# EAGLE schematic 909 Rim_potless (EAGLE 7.1.0)
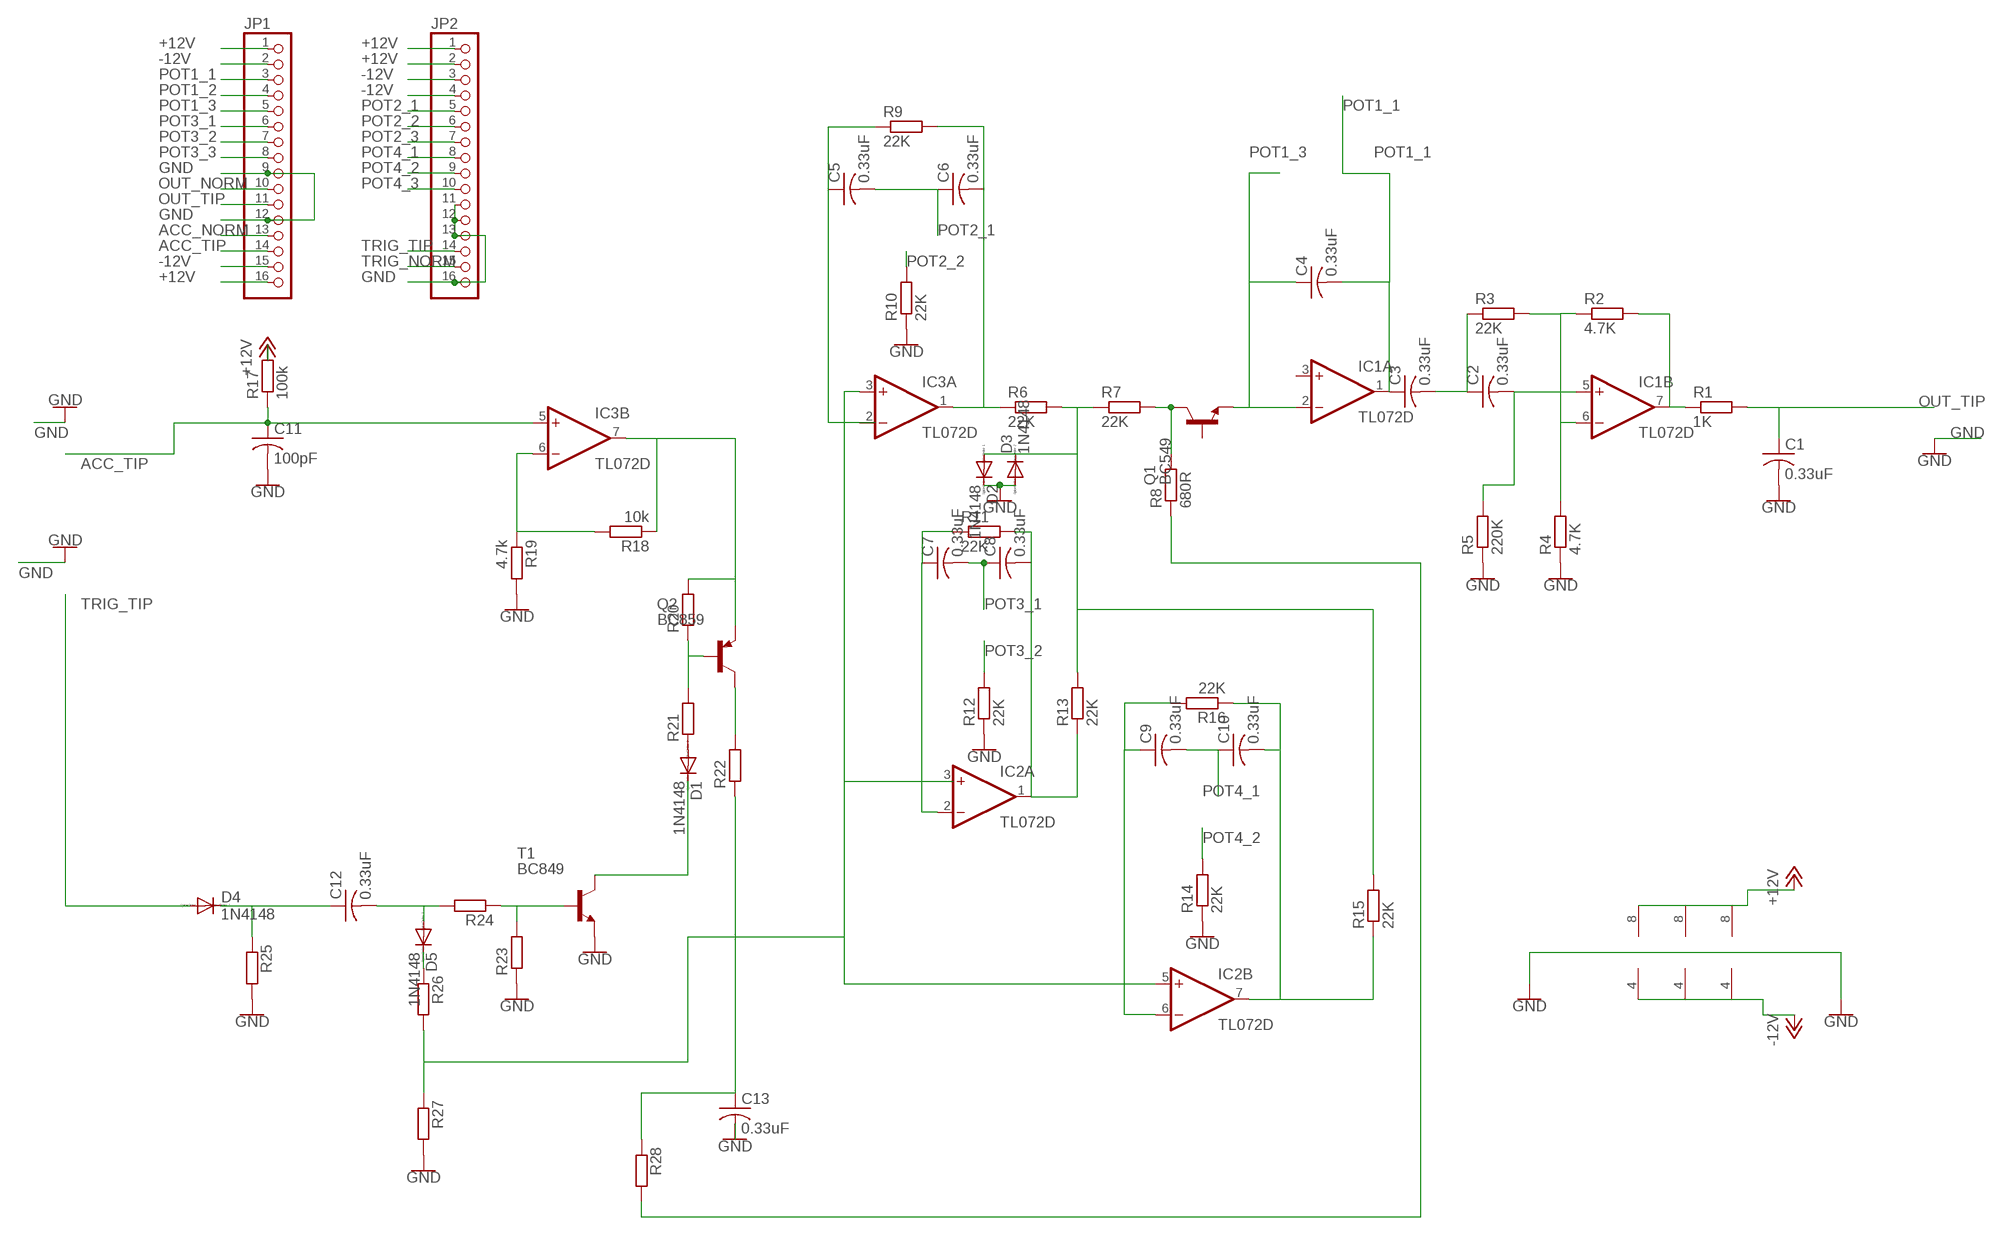
[diagram p0: schematic, sheet 1]

## Parts
C1  0.33uF  C-USC0603K  [C0603K]
C2  0.33uF  C-USC0603K  [C0603K]
C3  0.33uF  C-USC0603K  [C0603K]
C4  0.33uF  C-USC0603K  [C0603K]
C5  0.33uF  C-USC0603K  [C0603K]
C6  0.33uF  C-USC0603K  [C0603K]
C7  0.33uF  C-USC0603K  [C0603K]
C8  0.33uF  C-USC0603K  [C0603K]
C9  0.33uF  C-USC0603K  [C0603K]
C10  0.33uF  C-USC0603K  [C0603K]
C11  100pF  C-USC0603K  [C0603K]
C12  0.33uF  C-USC0603K  [C0603K]
C13  0.33uF  C-USC0603K  [C0603K]
D1  1N4148  1N4148SOD-323  [SOD323W_INFINEON]
D2  1N4148  1N4148SOD-323  [SOD323W_INFINEON]
D3  1N4148  1N4148SOD-323  [SOD323W_INFINEON]
D4  1N4148  1N4148SOD-323  [SOD323W_INFINEON]
D5  1N4148  1N4148SOD-323  [SOD323W_INFINEON]
IC1  TL072D  [SO08]
IC2  TL072D  [SO08]
IC3  TL072D  [SO08]
JP1  PINHD-1X16  [1X16]
JP2  PINHD-1X16  [1X16]
Q1  BC549  BC849  [SOT23]
Q2  BC859  BC857ASMD  [SOT23-BEC]
R1  1K  R-EU_R0603  [R0603]
R2  4.7K  R-EU_R0603  [R0603]
R3  22K  R-EU_R0603  [R0603]
R4  4.7K  R-EU_R0603  [R0603]
R5  220K  R-EU_R0603  [R0603]
R6  22K  R-EU_R0603  [R0603]
R7  22K  R-EU_R0603  [R0603]
R8  680R  R-EU_R0603  [R0603]
R9  22K  R-EU_R0603  [R0603]
R10  22K  R-EU_R0603  [R0603]
R11  22K  R-EU_R0603  [R0603]
R12  22K  R-EU_R0603  [R0603]
R13  22K  R-EU_R0603  [R0603]
R14  22K  R-EU_R0603  [R0603]
R15  22K  R-EU_R0603  [R0603]
R16  22K  R-EU_R0603  [R0603]
R17  100k  R-EU_R0603  [R0603]
R18  10k  R-EU_R0603  [R0603]
R19  4.7k  R-EU_R0603  [R0603]
R20  R-EU_R0603  [R0603]
R21  R-EU_R0603  [R0603]
R22  R-EU_R0603  [R0603]
R23  R-EU_R0603  [R0603]
R24  R-EU_R0603  [R0603]
R25  R-EU_R0603  [R0603]
R26  R-EU_R0603  [R0603]
R27  R-EU_R0603  [R0603]
R28  R-EU_R0603  [R0603]
T1  BC849  [SOT23]

## Nets
+12V: IC1.8(P:V+) JP1.1 JP1.16 JP2.1 JP2.2 R17.2
-12V: IC1.4(P:V-) JP1.2 JP1.15 JP2.3 JP2.4
ACC_NORM: JP1.13
ACC_TIP: C11.1 IC3.5(B:+IN) JP1.14 R17.1
GND: C1.2 C11.2 C13.2 D2.C D3.A JP1.9 JP1.12 JP2.11 JP2.12 JP2.13 JP2.16 R4.1 R5.1 R10.1 R12.1 R14.1 R19.2 R23.1 R25.2 R27.2 T1.2(E)
N$1: IC1.7(B:OUT) R1.1 R2.2
N$3: C2.1 C3.2 R3.1
N$4: C2.2 IC1.5(B:+IN) R5.2
N$5: IC1.6(B:-IN) R2.1 R3.2 R4.2
N$8: D2.A R6.2 R7.1 R13.2 R15.2
N$9: C6.2 IC3.1(A:OUT) R6.1 R9.2
N$10: Q1.3(C) R7.2 R8.2
N$11: C5.1 R9.1
N$15: C10.2 IC2.7(B:OUT) R15.1 R16.1
N$17: C8.2 IC2.1(A:OUT) R11.2 R13.1
N$18: C9.1 IC2.6(B:-IN) R16.2
N$19: R8.1 R28.2
N$21: IC3.6(B:-IN) R18.2 R19.1
N$22: IC3.7(B:OUT) Q2.E R18.1 R20.2
N$23: Q2.B R20.1 R21.2
N$24: Q2.C R22.2
N$25: D1.A R21.1
N$26: D5.C R26.1
N$27: C12.1 D4.C R25.1
N$28: C12.2 D5.A R24.2
N$29: IC2.5(B:+IN) IC3.3(A:+IN) R26.2 R27.1
N$30: R23.2 R24.1 T1.1(B)
N$31: D1.C T1.3(C)
N$32: C13.1 R22.1 R28.1
N$37: C7.1 IC2.2(A:-IN) R11.1
OUT_NORM: JP1.10
OUT_TIP: C1.1 JP1.11 R1.2
POT1_1: C3.1 C4.2 IC1.1(A:OUT) JP1.3
POT1_2: JP1.4
POT1_3: C4.1 IC1.2(A:-IN) JP1.5 Q1.2(E)
POT2_1: C5.2 C6.1 JP2.5
POT2_2: JP2.6 R10.2
POT2_3: JP2.7
POT3_1: C7.2 C8.1 JP1.6
POT3_2: JP1.7 R12.2
POT3_3: JP1.8
POT4_1: C9.2 C10.1 JP2.8
POT4_2: JP2.9 R14.2
POT4_3: JP2.10
TRIG_NORM: JP2.15
TRIG_TIP: D4.A JP2.14
Unconnected: D3.C IC1.3(A:+IN) IC2.3(A:+IN) IC3.2(A:-IN) Q1.1(B)

## Power pins joined to a net without a drawn wire
V+: IC2.8(P:V+) IC3.8(P:V+)
V-: IC2.4(P:V-) IC3.4(P:V-)

## Library data of the parts
C1-C13 = resistor:C-US: CAPACITOR, American symbol
D1-D5 = 0000-master:1N4148: DIODE high speed (Philips)
IC1-IC3 = linear:TL072: OP AMP
JP1 JP2 = pinhead:PINHD-1X16: PIN HEADER
Q1 T1 = transistor-neu-to92:BC849: NPN TRANSISTOR
Q2 = transistor-pnp:BC857*: PNP Transistror
R1-R28 = resistor:R-EU_: RESISTOR, European symbol; SPICEPREFIX: R